# Altium project PCB_LightStateRF.PrjPcb
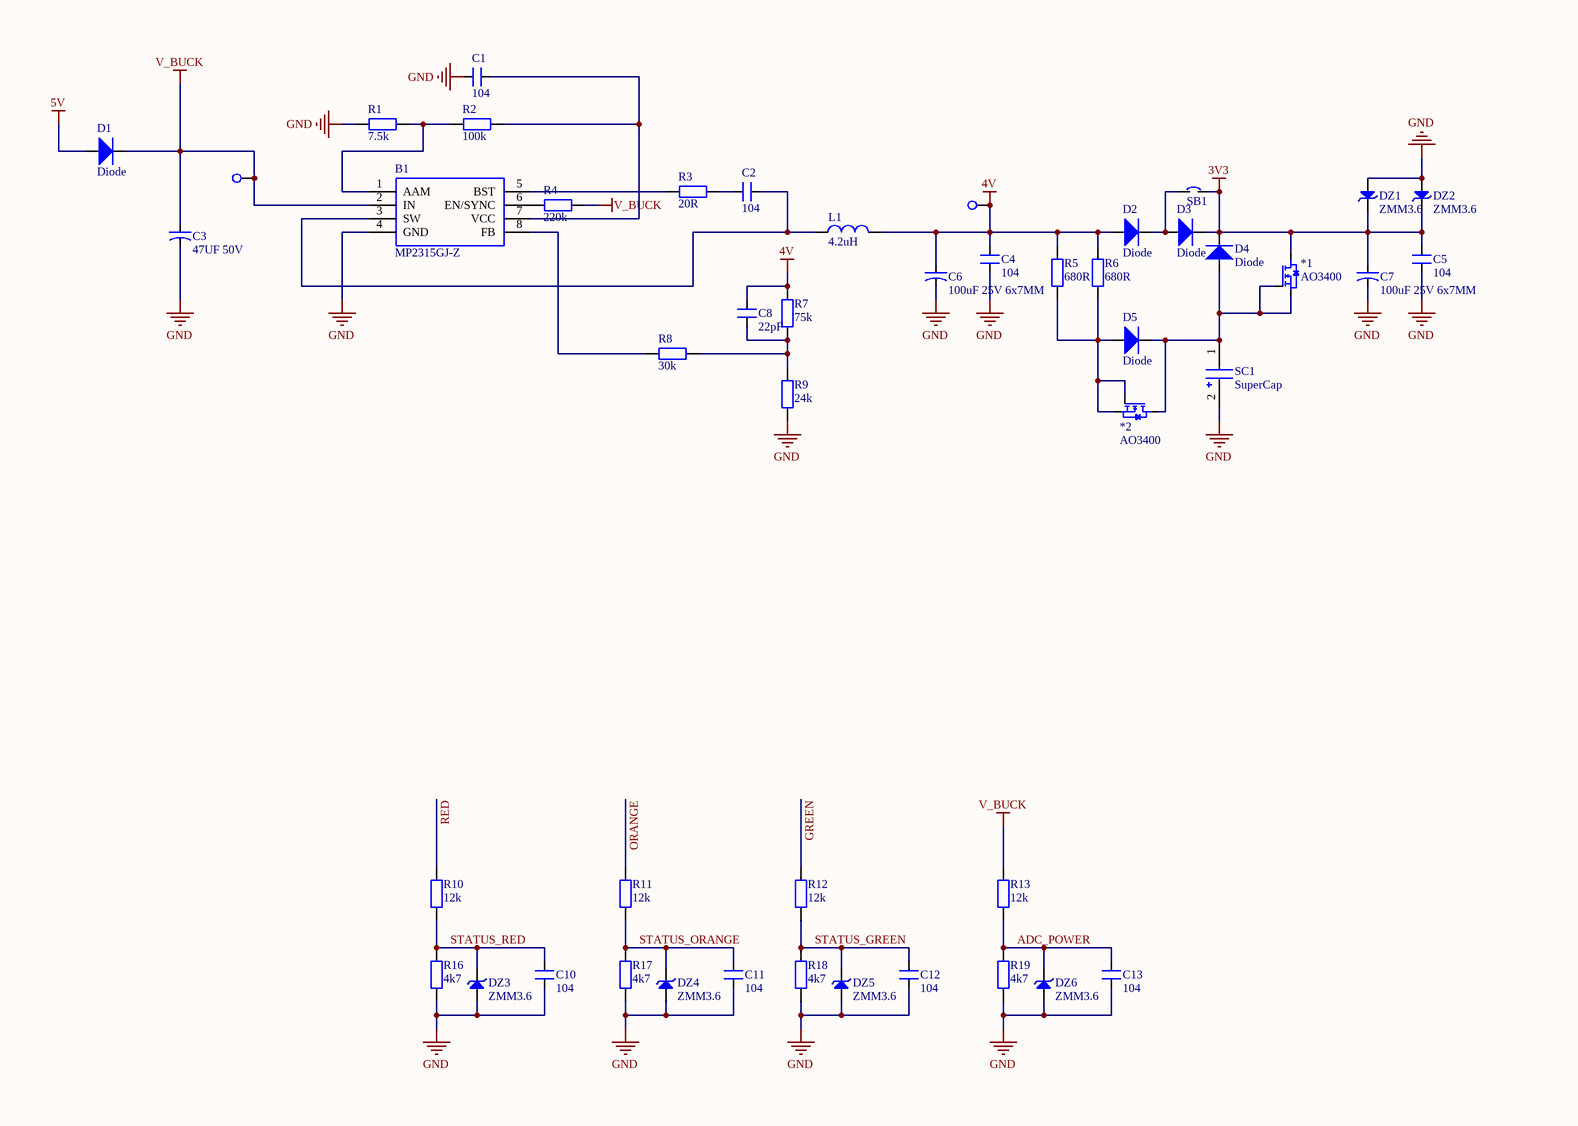
[diagram p0: LightStateRF.SchDoc, top left]
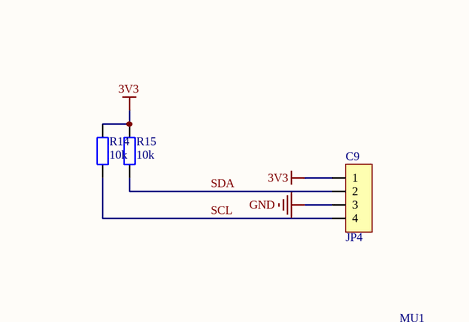
[diagram p1: LightStateRF.SchDoc, top right]
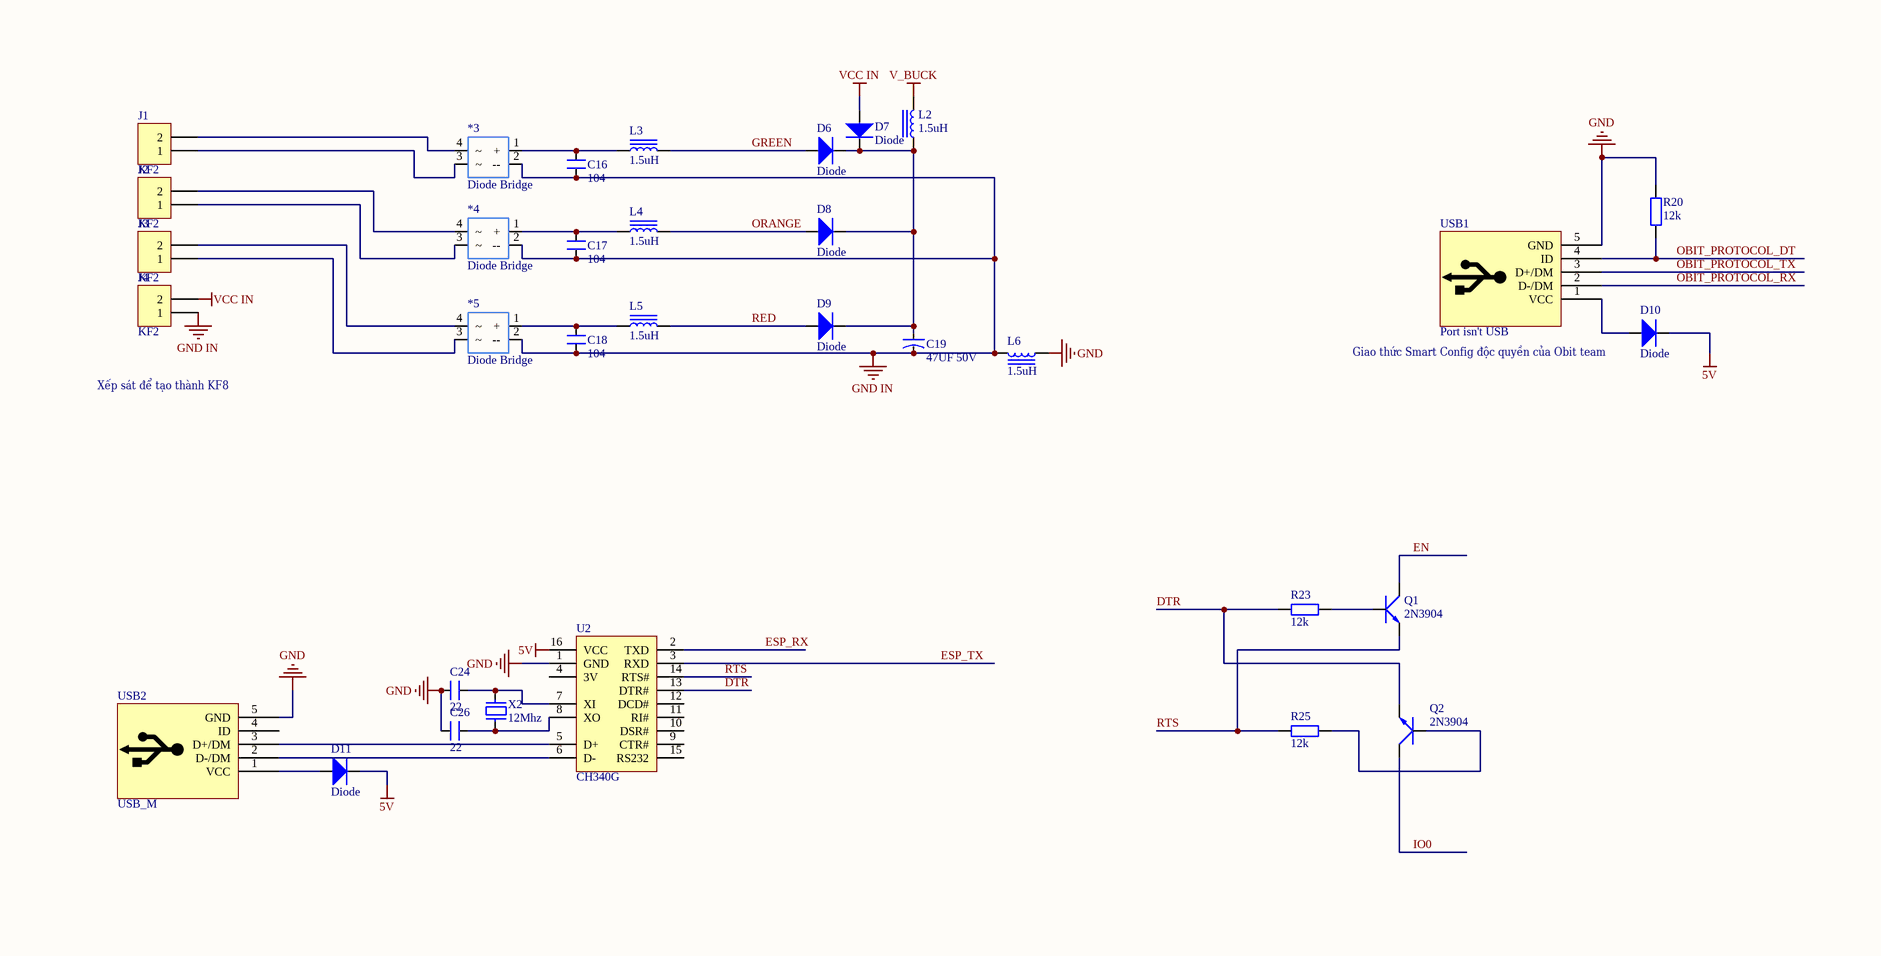
[diagram p2: LightStateRF.SchDoc, bottom left]
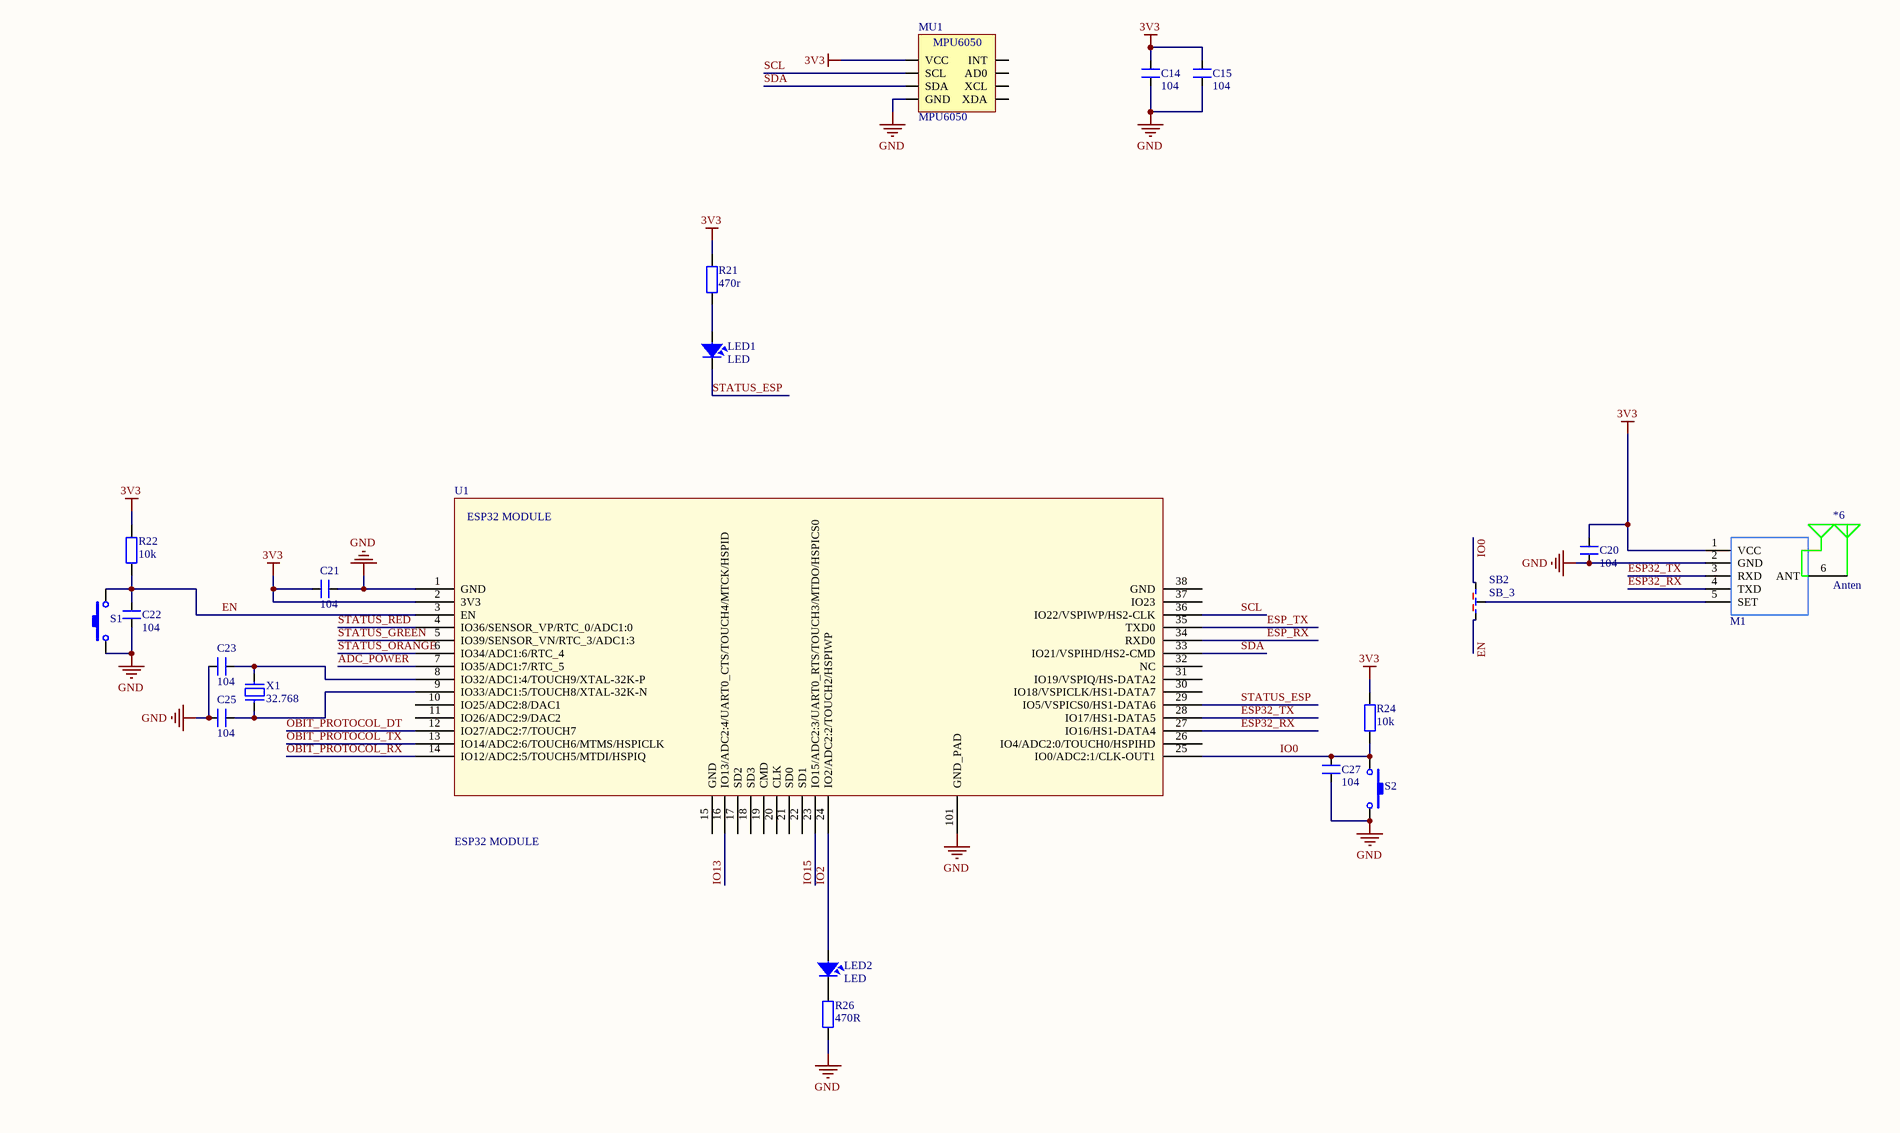
[diagram p3: LightStateRF.SchDoc, bottom right]
1 sheet, 106 parts. Net scope: global (net labels, ports and power ports of the same name join across sheets).
Board file: LightStateRF.PcbDoc

## Sheet LightStateRF.SchDoc
size A0

### Parts
*1  AO3400  [SOT23-123]
*2  AO3400  [SOT23-123]
*3  Diode Bridge  [Diode Bridge 1A]
*4  Diode Bridge  [Diode Bridge 1A]
*5  Diode Bridge  [Diode Bridge 1A]
*6  Anten  [LOXO_433_NGANG]
*TP1  TP  [TP]  (value not drawn)
*TP2  TP  [TP]  (value not drawn)
B1  MP2315GJ-Z  [SOT65P280X100-8N]
C1  104  [SM-0805]
C2  104  [SM-0805]
C3  47UF 50V  [CAP-ALU-SMD-6.3x7.7x2.2]
C4  104  [SM-0805]
C5  104  [SM-0805]
C6  100uF 25V 6x7MM  [CAP-ALU-SMD-6.3x7.7x2.2]
C7  100uF 25V 6x7MM  [CAP-ALU-SMD-6.3x7.7x2.2]
C8  22pF  [SM-0805]
C9  JP4  [JP4-C1T]
C10  104  [SM-0805]
C11  104  [SM-0805]
C12  104  [SM-0805]
C13  104  [SM-0805]
C14  104  [SM-0805]
C15  104  [SM-0805]
C16  104  [SM-0805]
C17  104  [SM-0805]
C18  104  [SM-0805]
C19  47UF 50V  [CAP-ALU-SMD-6.3x7.7x2.2]
C20  104  [SM-0805]
C21  104  [SM-0805]
C22  104  [SM-0805]
C23  104  [SM-0805]
C24  22  [SM-0805]
C25  104  [SM-0805]
C26  22  [SM-0805]
C27  104  [SM-0805]
D1  Diode  [SOD123]
D2  Diode  [DIO-SMD-123]
D3  Diode  [DIO-SMD-123]
D4  Diode  [DIO-SMD-123]
D5  Diode  [SOD123]
D6  Diode  [DIO-SMD-106]
D7  Diode  [DIO-SMD-106]
D8  Diode  [DIO-SMD-106]
D9  Diode  [DIO-SMD-106]
D10  Diode  [DIO-SMD-106]
D11  Diode  [DIO-SMD-106]
DZ1  ZMM3.6  [SOD123]
DZ2  ZMM3.6  [DIO-SMD-123]
DZ3  ZMM3.6  [SOD123]
DZ4  ZMM3.6  [SOD123]
DZ5  ZMM3.6  [SOD123]
DZ6  ZMM3.6  [SOD123]
J1  KF2  [KF2-5.08]
J2  KF2  [KF2-5.08]
J3  KF2  [KF2-5.08]
J4  KF2  [KF2-5.08]
L1  4.2uH  [IND 4532-2P]
L2  1.5uH  [FER 0805/2012]
L3  1.5uH  [FER 0805/2012]
L4  1.5uH  [FER 0805/2012]
L5  1.5uH  [FER 0805/2012]
L6  1.5uH  [FER 0805/2012]
LED1  LED  [SM-LED-0805-Blue]
LED2  LED  [SM-LED-0805-Blue]
M1  CC1101  [CC1101 UART HC11]  (value not drawn)
MU1  MPU6050  [MPU6050]
Q1  2N3904  [SOT23-231]
Q2  2N3904  [SOT23-231]
R1  7.5k  [RES-SMD-0805]
R2  100k  [RES-SMD-0805]
R3  20R  [RES-SMD-0805]
R4  220k  [RES-SMD-0805]
R5  680R  [RES-SMD-0805]
R6  680R  [RES-SMD-0805]
R7  75k  [RES-SMD-0805]
R8  30k  [RES-SMD-0805]
R9  24k  [RES-SMD-0805]
R10  12k  [RES-SMD-0805]
R11  12k  [RES-SMD-0805]
R12  12k  [RES-SMD-0805]
R13  12k  [RES-SMD-0805]
R14  10k  [RES-SMD-0805]
R15  10k  [RES-SMD-0805]
R16  4k7  [RES-SMD-0805]
R17  4k7  [RES-SMD-0805]
R18  4k7  [RES-SMD-0805]
R19  4k7  [RES-SMD-0805]
R20  12k  [RES-SMD-0805]
R21  470r  [RES-SMD-0805]
R22  10k  [RES-SMD-0805]
R23  12k  [RES-SMD-0805]
R24  10k  [RES-SMD-0805]
R25  12k  [RES-SMD-0805]
R26  470R  [RES-SMD-0805]
S1  SW  [BUTTON-SMD 2PIN]  (value not drawn)
S2  SW  [BUTTON-SMD 2PIN]  (value not drawn)
SB1  SB  [SB]  (value not drawn)
SB2  SB_3  [SB_3]
SC1  SuperCap  [SuperCapacitor]
U1  ESP32 MODULE  [ESP32S]
U2  CH340G  [SO16]
USB1  Port isn't USB  [USB-M1]
USB2  USB_M  [USB-M1]
X1  32.768  [XT32k]
X2  12Mhz  [XT2]

### Nets
3V3: *1.2 C5.2 C7.1 C9.1 C14.2 C15.2 C20.2 C21.2 D3.2 D4.2 DZ1.2(K) DZ2.2(K) M1.1(VCC) MU1.1(VCC) R14.2 R15.2 R21.2 R22.2 R24.1 SB1.2 U1.2(3V3)
4V: *TP2.1 C4.2 C6.1 C8.2 D2.1 L1.2 R5.1 R6.1 R7.1
5V: D1.1 D10.2 D11.2 U2.16(VCC)
GND: B1.4(GND) C1.2 C3.2 C4.1 C5.1 C6.2 C7.2 C9.3 C10.1 C11.1 C12.1 C13.1 C14.1 C15.1 C20.1 C21.1 C22.2 C23.2 C24.2 C25.2 C26.2 C27.1 DZ1.1(A) DZ2.1(A) DZ3.1(A) DZ4.1(A) DZ5.1(A) DZ6.1(A) L6.1 M1.2(GND) MU1.2(GND) R1.2 R9.2 R16.2 R17.2 R18.2 R19.2 R20.1 R26.2 S1.1 S2.2 SC1.2(-) U1.1(GND) U1.101(GND_PAD) U2.1(GND) USB1.5(GND) USB2.5(GND)
GND IN: *3.2(--) *4.2(--) *5.2(--) C16.1 C17.1 C18.1 C19.2 J4.1 L6.2
V_BUCK: *TP1.1 B1.2(IN) C3.1 D1.2 L2.2 R4.1 R13.1
VCC IN: D7.1 J4.2
ADC_POWER: C13.2 DZ6.2(K) R13.2 R19.1 U1.7(IO35/ADC1:7/RTC_5)
DTR: Q2.1(E) R23.2 U2.13(DTR#)
EN: C22.1 Q1.3(C) R22.1 S1.2 SB2.1 U1.3(EN)
ESP32_RX: M1.4(TXD) U1.27(IO16/HS1-DATA4)
ESP32_TX: M1.3(RXD) U1.28(IO17/HS1-DATA5)
ESP_RX: U1.34(RXD0) U2.2(TXD)
ESP_TX: U1.35(TXD0) U2.3(RXD)
GREEN: D6.1 L3.2 R12.1
IO0: C27.2 Q2.3(C) R24.2 S2.1 SB2.3 U1.25(IO0/ADC2:1/CLK-OUT1)
IO2: LED2.1 U1.24(IO2/ADC2:2/TOUCH2/HSPIWP)
IO13: U1.16(IO13/ADC2:4/UART0_CTS/TOUCH4/MTCK/HSPID)
IO15: U1.23(IO15/ADC2:3/UART0_RTS/TOUCH3/MTDO/HSPICS0)
OBIT_PROTOCOL_DT: R20.2 U1.12(IO27/ADC2:7/TOUCH7) USB1.4(ID)
OBIT_PROTOCOL_RX: U1.14(IO12/ADC2:5/TOUCH5/MTDI/HSPIQ) USB1.2(D-/DM)
OBIT_PROTOCOL_TX: U1.13(IO14/ADC2:6/TOUCH6/MTMS/HSPICLK) USB1.3(D+/DM)
ORANGE: D8.1 L4.2 R11.1
RED: D9.1 L5.2 R10.1
RTS: Q1.1(E) R25.2 U2.14(RTS#)
SCL: C9.4 MU1.3(SCL) R14.1 U1.36(IO22/VSPIWP/HS2-CLK)
SDA: C9.2 MU1.4(SDA) R15.1 U1.33(IO21/VSPIHD/HS2-CMD)
STATUS_ESP: LED1.2 U1.29(IO5/VSPICS0/HS1-DATA6)
STATUS_GREEN: C12.2 DZ5.2(K) R12.2 R18.1 U1.5(IO39/SENSOR_VN/RTC_3/ADC1:3)
STATUS_ORANGE: C11.2 DZ4.2(K) R11.2 R17.1 U1.6(IO34/ADC1:6/RTC_4)
STATUS_RED: C10.2 DZ3.2(K) R10.2 R16.1 U1.4(IO36/SENSOR_VP/RTC_0/ADC1:0)
Net*1_1: *1.1 *1.3 *2.2 D4.1 D5.2 SC1.1(+)
Net*2_1: *2.1 *2.3 D5.1 R5.2 R6.2
Net*3_1: *3.1(+) C16.2 L3.1
Net*3_3: *3.3 J1.1
Net*3_4: *3.4 J1.2
Net*4_1: *4.1(+) C17.2 L4.1
Net*4_3: *4.3 J2.1
Net*4_4: *4.4 J2.2
Net*5_1: *5.1(+) C18.2 L5.1
Net*5_3: *5.3 J3.1
Net*5_4: *5.4 J3.2
Net*6_1: *6.1 M1.6(ANT)
NetB1_1: B1.1(AAM) R1.1 R2.2
NetB1_3: B1.3(SW) C2.1 L1.1
NetB1_5: B1.5(BST) R3.2
NetB1_6: B1.6(EN/SYNC) R4.2
NetB1_7: B1.7(VCC) C1.1 R2.1
NetB1_8: B1.8(FB) R8.1
NetC2_2: C2.2 R3.1
NetC8_1: C8.1 R7.2 R8.2 R9.1
NetC19_1: C19.1 D6.2 D7.2 D8.2 D9.2 L2.1
NetC23_1: C23.1 U1.8(IO32/ADC1:4/TOUCH9/XTAL-32K-P) X1.2
NetC24_1: C24.1 U2.7(XI) X2.2
NetC25_1: C25.1 U1.9(IO33/ADC1:5/TOUCH8/XTAL-32K-N) X1.1
NetC26_1: C26.1 U2.8(XO) X2.1
NetD2_2: D2.2 D3.1 SB1.1
NetD10_1: D10.1 USB1.1(VCC)
NetD11_1: D11.1 USB2.1(VCC)
NetLED1_1: LED1.1 R21.1
NetLED2_2: LED2.2 R26.1
NetM1_5: M1.5(SET) SB2.2
NetQ1_2: Q1.2(B) R23.1
NetQ2_2: Q2.2(B) R25.1
NetU2_5: U2.5(D+) USB2.3(D+/DM)
NetU2_6: U2.6(D-) USB2.2(D-/DM)

Not connected (* = marked no-connect by the designer): MU1 5(XDA) 6(XCL) 7(AD0) 8(INT); U1 10(IO25/ADC2:8/DAC1) 11(IO26/ADC2:9/DAC2) 15(GND) 17(SD2) 18(SD3) 19(CMD) 20(CLK) 21(SD0) 22(SD1) 26(IO4/ADC2:0/TOUCH0/HSPIHD) 30(IO18/VSPICLK/HS1-DATA7) 31(IO19/VSPIQ/HS-DATA2) 32(NC) 37(IO23) 38(GND); U2 4(3V) 9(CTR#) 10(DSR#) 11(RI#) 12(DCD#) 15(RS232); USB2 4(ID)

### Notes on the sheet
- Xếp sát để tạo thành KF8
- (near D10) Giao thức Smart Config độc quyền của Obit team

### Library data of the parts
B1 = MP2315GJ-Z: Switching Voltage Regulators 3A 24V 500kHz Sync buck; Manufacturer_Name: Monolithic Power Systems (MPS); Geometry.Height: 1mm; Manufacturer_Part_Number: MP2315GJ-Z; RS Part Number: *; RS Price/Stock: *; Arrow Part Number: MP2315GJ-Z; Arrow Price/Stock: *; Datasheet Link: https://componentsearchengine.com/Datasheets/1/MP2315GJ-Z.pdf
C1 C2 C4 C5 C8 C10-C18 C20-C27 = CM: Cap SMD; Value: 103
C3 C19 = CN-ALU-SMD: Tụ Nhôm 47UF 50V 6.3x5.5MM; Published: 8-Jun-2000; LatestRevisionDate: 17-Jul-2002; LatestRevisionNote: Re-released for DXP Platform.; PackageReference: POLAR0.8; Publisher: Altium Limited
C6 C7 = CN-ALU-SMD: Polarized Capacitor (Axial); Published: 8-Jun-2000; LatestRevisionDate: 17-Jul-2002; LatestRevisionNote: Re-released for DXP Platform.; PackageReference: POLAR0.8; Publisher: Altium Limited
C9 = JP4: WR-PHD 2.54 mm Angled Socket Header; Manufacturer: W¨¹rth Elektronik eiSos GmbH; partNo: 613004143121; ComponentLink1 Description: Manufacturer; ComponentLink2 Description: Datasheet; NoPins: 04; Created Date: 29 March 2013; ComponentLink1URL: http://www.we-online.com; ComponentLink2URL: http://katalog.we-online.de/em/datasheet/6130xx143121.pdf; Created by: Karrer Zheng
DZ1-DZ6 = DIODE Zener: DIODE GEN PURP 75V 200MA LLDS
J1-J4 = KF2: Manufacturer: Würth Elektronik eiSos GmbH; partNo: 691103110002; ComponentLink1 Description: Manufacturer; ComponentLink2 Description: Datasheet; NoPins: 2; Created Date: 29 October 2013; ComponentLink1URL: http://www.we-online.com; ComponentLink2URL: http://katalog.we-online.de/em/datasheet/6911031100xx.pdf; Created by: Karrer Zheng
L1 = INDUCTOR B
L2-L6 = Inductor: SMT Inductor; Value: 1.5uH
M1 = CC1101 UART HC11: OBIT TEAM / CC1101 UART 433MHZ
MU1 = MPU6050: Manufacturer: W¨¹rth Elektronik eiSos GmbH; partNo: 613004143121; ComponentLink1 Description: Manufacturer; ComponentLink2 Description: Datasheet; NoPins: 04; Created Date: 29 March 2013; ComponentLink1URL: http://www.we-online.com; ComponentLink2URL: http://katalog.we-online.de/em/datasheet/6130xx143121.pdf; Created by: Karrer Zheng
Q1 Q2 = 2N3904: NPN 600mW, ECB; Value: C1815
R1-R26 = R: Resistor R1/4W
S1 S2 = SW-Button: Switch-Button; Published: 24-Mar-1999; LatestRevisionDate: 17-Jul-2002; LatestRevisionNote: Re-released for DXP Platform.; PackageReference: SPST-2; Publisher: Altium Limited
SC1 = 5.5V 0.22F
U2 = CH340G: High and Low Side Driver; Note: Pins 4, 8 and 14 are not connected; Published: 8-Jun-2000; LatestRevisionDate: 04-Mar-2005; LatestRevisionNote: Stylized 3D Model Added.; DatasheetVersion: PD60147J; PackageReference: PDIP14; Publisher: Altium Limited; PackageDescription: DIP; 14 Leads; Row Spacing 7.62 mm; Pitch 2.54 mm; ComponentLink1Description: Manufacturer Link; ComponentLink1URL: http://www.irf.com/; ComponentLink2Description: Datasheet; ComponentLink2URL: http://www.irf.com/product-info/datasheets/data/ir2110.pdf
USB1 = USB_M
X1 X2 = XT2: Crystal, 32.768 KHz, -40 to 85 degC, 3.2 x 1.5 x 0.9 mm SMD; Value: 4Mhz